# Altium schematic sheet Perpiherals.SchDoc
size 309 x 193 mm; SheetNumber: 3; SheetTotal: 3
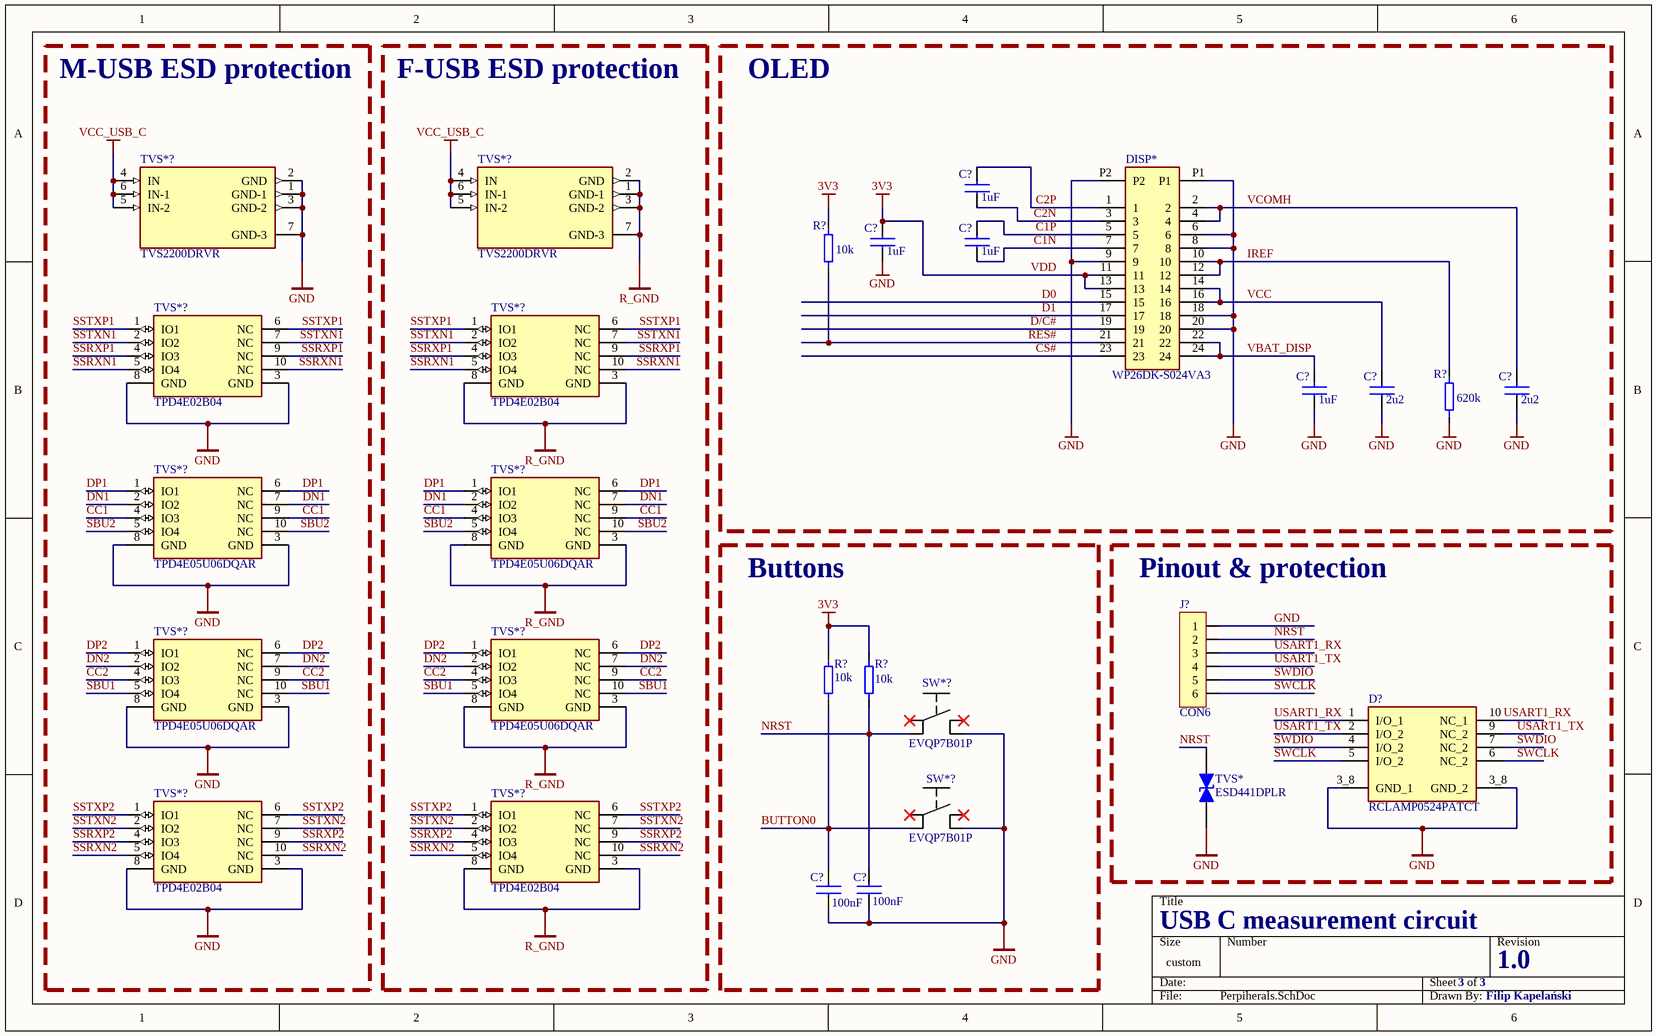
[diagram p0: Perpiherals.SchDoc]

## Parts
(Parts that share a designator on the sheet are numbered #1, #2 ... from top to bottom, then left to right.)
C?#1  1uF  [C0402]
C?#2  1uF  [C0402]
C?#3  1uF  [C0402]
C?#4  1uF  [C0402]
C?#5  2u2  [C0402]
C?#6  2u2  [C0402]
C?#7  100nF  [C0402]
C?#8  100nF  [C0402]
D?  RCLAMP0524PATCT  [DIO_RCLAMP0524PATCT]
DISP*  WP26DK-S024VA3  [WP26DK-S024VA3]
J?  CON6  [SIP6]
R?#1  10k  [R0402]
R?#2  620k  [R0402]
R?#3  10k  [R0402]
R?#4  10k  [R0402]
SW*?#1  EVQP7B01P  [EVQP7B01P]
SW*?#2  EVQP7B01P  [EVQP7B01P]
TVS*  ESD441DPLR  [ESD441DPLR]
TVS*?#1  TVS2200DRVR  [TVS2200DRVR]
TVS*?#2  TVS2200DRVR  [TVS2200DRVR]
TVS*?#3  TPD4E02B04  [TPD4E02B04]
TVS*?#4  TPD4E02B04  [TPD4E02B04]
TVS*?#5  TPD4E05U06DQAR  [TPD4E05U06DQAR]
TVS*?#6  TPD4E05U06DQAR  [TPD4E05U06DQAR]
TVS*?#7  TPD4E05U06DQAR  [TPD4E05U06DQAR]
TVS*?#8  TPD4E05U06DQAR  [TPD4E05U06DQAR]
TVS*?#9  TPD4E02B04  [TPD4E02B04]
TVS*?#10  TPD4E02B04  [TPD4E02B04]

## Blocks framed on the sheet
M-USB ESD protection: TVS*?#1 TVS*?#3 TVS*?#5 TVS*?#7 TVS*?#9
F-USB ESD protection: TVS*?#2 TVS*?#4 TVS*?#6 TVS*?#8 TVS*?#10
OLED: C?#1-C?#6 DISP* R?#1 R?#2
Buttons: C?#7 C?#8 R?#3 R?#4 SW*?#1 SW*?#2
Pinout & protection: D? J? TVS*

## Nets
GND: C?#2.1 C?#4.1 C?#5.1 C?#6.1 C?#7.1 C?#8.1 D?.3_8(GND_1) DISP*.6 DISP*.8 DISP*.9 DISP*.18 DISP*.20 DISP*.P1 DISP*.P2 J?.1 R?#2.2 SW*?#1.2(S) SW*?#2.2(S) TVS*.1 TVS*?#1.1(GND-1) TVS*?#1.2(GND) TVS*?#1.3(GND-2) TVS*?#1.7(GND-3) TVS*?#3.3(GND) TVS*?#3.8(GND) TVS*?#5.3(GND) TVS*?#5.8(GND) TVS*?#7.3(GND) TVS*?#7.8(GND) TVS*?#9.3(GND) TVS*?#9.8(GND)
R_GND: TVS*?#2.1(GND-1) TVS*?#2.2(GND) TVS*?#2.3(GND-2) TVS*?#2.7(GND-3) TVS*?#4.3(GND) TVS*?#4.8(GND) TVS*?#6.3(GND) TVS*?#6.8(GND) TVS*?#8.3(GND) TVS*?#8.8(GND) TVS*?#10.3(GND) TVS*?#10.8(GND)
VCC_USB_C: TVS*?#1.4(IN) TVS*?#1.5(IN-2) TVS*?#1.6(IN-1) TVS*?#2.4(IN) TVS*?#2.5(IN-2) TVS*?#2.6(IN-1)
VDD: C?#2.2 DISP*.11 DISP*.13 R?#1.1 R?#3.1 R?#4.1  [also labelled 3V3]
BUTTON0: C?#7.2 R?#3.2 SW*?#2.1(P)
C1N: C?#3.1 DISP*.7
C1P: C?#3.2 DISP*.5
C2N: C?#1.1 DISP*.3
C2P: C?#1.2 DISP*.1
CC1: TVS*?#5.4(IO3) TVS*?#5.9(NC) TVS*?#6.4(IO3) TVS*?#6.9(NC)
CC2: TVS*?#7.4(IO3) TVS*?#7.9(NC) TVS*?#8.4(IO3) TVS*?#8.9(NC)
CS#: DISP*.23
D0: DISP*.15
D1: DISP*.17
D/C#: DISP*.19
DN1: TVS*?#5.2(IO2) TVS*?#5.7(NC) TVS*?#6.2(IO2) TVS*?#6.7(NC)
DN2: TVS*?#7.2(IO2) TVS*?#7.7(NC) TVS*?#8.2(IO2) TVS*?#8.7(NC)
DP1: TVS*?#5.1(IO1) TVS*?#5.6(NC) TVS*?#6.1(IO1) TVS*?#6.6(NC)
DP2: TVS*?#7.1(IO1) TVS*?#7.6(NC) TVS*?#8.1(IO1) TVS*?#8.6(NC)
IREF: DISP*.10 DISP*.12 R?#2.1
NRST: C?#8.2 J?.2 R?#4.2 SW*?#1.1(P) TVS*.2
RES#: DISP*.21 R?#1.2
SBU1: TVS*?#7.5(IO4) TVS*?#7.10(NC) TVS*?#8.5(IO4) TVS*?#8.10(NC)
SBU2: TVS*?#5.5(IO4) TVS*?#5.10(NC) TVS*?#6.5(IO4) TVS*?#6.10(NC)
SSRXN1: TVS*?#3.5(IO4) TVS*?#3.10(NC) TVS*?#4.5(IO4) TVS*?#4.10(NC)
SSRXN2: TVS*?#9.5(IO4) TVS*?#9.10(NC) TVS*?#10.5(IO4) TVS*?#10.10(NC)
SSRXP1: TVS*?#3.4(IO3) TVS*?#3.9(NC) TVS*?#4.4(IO3) TVS*?#4.9(NC)
SSRXP2: TVS*?#9.4(IO3) TVS*?#9.9(NC) TVS*?#10.4(IO3) TVS*?#10.9(NC)
SSTXN1: TVS*?#3.2(IO2) TVS*?#3.7(NC) TVS*?#4.2(IO2) TVS*?#4.7(NC)
SSTXN2: TVS*?#9.2(IO2) TVS*?#9.7(NC) TVS*?#10.2(IO2) TVS*?#10.7(NC)
SSTXP1: TVS*?#3.1(IO1) TVS*?#3.6(NC) TVS*?#4.1(IO1) TVS*?#4.6(NC)
SSTXP2: TVS*?#9.1(IO1) TVS*?#9.6(NC) TVS*?#10.1(IO1) TVS*?#10.6(NC)
SWCLK: D?.5(I/O_2) D?.6(NC_2) J?.6
SWDIO: D?.4(I/O_2) D?.7(NC_2) J?.5
USART1_RX: D?.1(I/O_1) D?.10(NC_1) J?.3
USART1_TX: D?.2(I/O_2) D?.9(NC_2) J?.4
VBAT_DISP: C?#4.2 DISP*.22 DISP*.24
VCC: C?#5.2 DISP*.14 DISP*.16
VCOMH: C?#6.2 DISP*.2 DISP*.4

Not connected (* = marked no-connect by the designer): SW*?#1 1'(P1)* 2'(S1)*; SW*?#2 1'(P1)* 2'(S1)*

## Notes on the sheet
- USB C measurement circuit
- 3
- 1.0
- Filip Kapelański

## Library data of the parts
C?#1-C?#8 = C: Kondensator ceramiczny SMD; Supplier: *; SupplierURL: *; helpurl: *; Manufacturer: *; PartNumber: *; Price: *; Symbol: *; Package: *; Voltage: *
  C?#1-C?#4: Value: 1uF
  C?#5 C?#6: Value: 2u2
  C?#7 C?#8: Value: 100nF
D? = RCLAMP0524PATCT: 15V Clamp 5A (8/20Âµs) Ipp Tvs Diode Surface Mount SLP2510P8; MF: Semtech Corporation; SnapEDA_Link: https://www.snapeda.com/parts/RCLAMP0524PATCT/Semtech+Corporation/view-part/?ref=snap; Package: UFDFN-10 Semtech; Value: *; MP: RCLAMP0524PATCT; Check_prices: https://www.snapeda.com/parts/RCLAMP0524PATCT/Semtech+Corporation/view-part/?ref=eda
J? = CON6: Connector
R?#1-R?#4 = R: Rezystor SMD; Supplier: *; SupplierURL: *; helpurl: *; Manufacturer: *; PartNumber: *; Price: *; Symbol: *; Package: *
  R?#1 R?#3 R?#4: Value: 10k
  R?#2: Value: 620k
SW*?#1 SW*?#2 = EVQP7B01P: Switch Tactile N.O. SPST Rectangular Button J-Bend 0.05A 12VDC 2.2N SMD T/R
TVS* = ESD441DPLR: 1-pF, 5.5-V, 30-KV ESD protection device in 0201 package; ComponentLink1Description: New link; ComponentLink1URL: https://www.mouser.pl/ProductDetail/Texas-Instruments/ESD441DPLR?qs=1Kr7Jg1SGW9UQFJqGMkN7Q%3D%3D
TVS*?#1 TVS*?#2 = TVS2200DRVR: 22V flat-clamp surge protection device; ComponentLink1Description: New link; ComponentLink1URL: https://www.mouser.pl/ProductDetail/Texas-Instruments/TVS2200DRVR?qs=W0yvOO0ixfHPbvei2cYdIw%3D%3D
TVS*?#5-TVS*?#8 = TPD4E05U06DQAR: ESD Protection Diodes / TVS Diodes 0.66-pF +/-3.6-V +/- 30-kV ESD protectio; ComponentLink1Description: New link; ComponentLink1URL: https://www.mouser.pl/ProductDetail/Texas-Instruments/TPD4E05U06DQAR?qs=%2FCrDlo5IrVPi4woOvWz0qA%3D%3D